# Altium schematic sheet GSM Output Port.SchDoc: GSM Output Port
size 292 x 193 mm; SheetNumber: 3; SheetTotal: 28
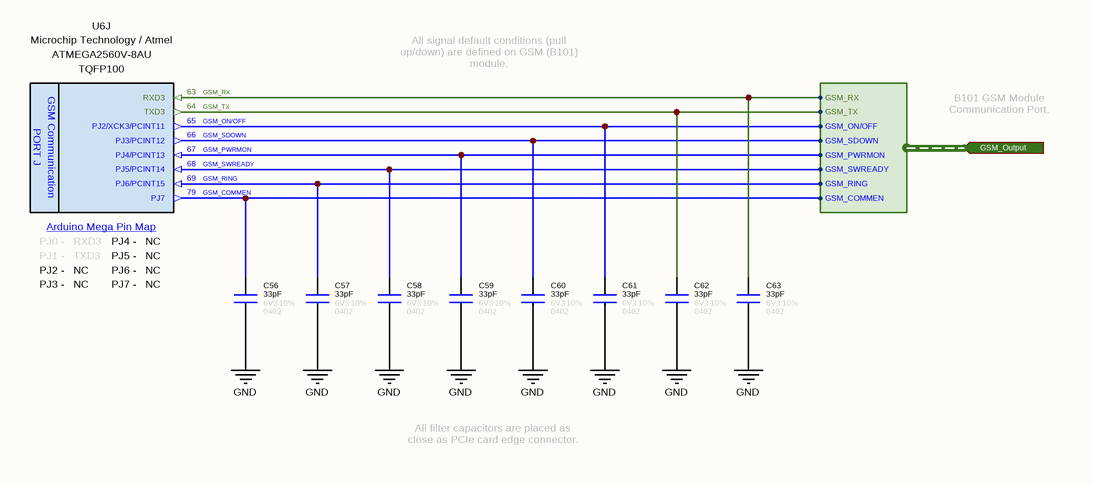
[diagram p0: GSM Output Port.SchDoc]

## Parts
C56  value 33pF  Tolerance: 10%  Case: 0402  Voltage: 6V3  [CAPACITOR_0402]  (hidden comment: Capacitor - 33pF [0402] (Ceramic))
C57  value 33pF  Tolerance: 10%  Case: 0402  Voltage: 6V3  [CAPACITOR_0402]  (hidden comment: Capacitor - 33pF [0402] (Ceramic))
C58  value 33pF  Tolerance: 10%  Case: 0402  Voltage: 6V3  [CAPACITOR_0402]  (hidden comment: Capacitor - 33pF [0402] (Ceramic))
C59  value 33pF  Tolerance: 10%  Case: 0402  Voltage: 6V3  [CAPACITOR_0402]  (hidden comment: Capacitor - 33pF [0402] (Ceramic))
C60  value 33pF  Tolerance: 10%  Case: 0402  Voltage: 6V3  [CAPACITOR_0402]  (hidden comment: Capacitor - 33pF [0402] (Ceramic))
C61  value 33pF  Tolerance: 10%  Case: 0402  Voltage: 6V3  [CAPACITOR_0402]  (hidden comment: Capacitor - 33pF [0402] (Ceramic))
C62  value 33pF  Tolerance: 10%  Case: 0402  Voltage: 6V3  [CAPACITOR_0402]  (hidden comment: Capacitor - 33pF [0402] (Ceramic))
C63  value 33pF  Tolerance: 10%  Case: 0402  Voltage: 6V3  [CAPACITOR_0402]  (hidden comment: Capacitor - 33pF [0402] (Ceramic))
U6  Manufacturer Name: Microchip Technology / Atmel  Case: TQFP100  [TQFP-100]  (hidden comment: ATMEGA2560V-8AU)  (part J of 16)

## Ports
GSM_Output (in, harness GSM_Output)

## Harnesses
GSM_Output: GSM_SDOWN, GSM_ON/OFF, GSM_TX, GSM_RX, GSM_PWRMON, GSM_SWREADY, GSM_RING, GSM_COMMEN

## Nets
GND: C56.1 C57.1 C58.1 C59.1 C60.1 C61.1 C62.1 C63.1
GSM_COMMEN: C56.2 U6.79(PJ7) ; port GSM_Output.GSM_COMMEN
GSM_ON/OFF: C61.2 U6.65(PJ2/XCK3/PCINT11) ; port GSM_Output.GSM_ON/OFF
GSM_PWRMON: C59.2 U6.67(PJ4/PCINT13) ; port GSM_Output.GSM_PWRMON
GSM_RING: C57.2 U6.69(PJ6/PCINT15) ; port GSM_Output.GSM_RING
GSM_RX: C63.2 U6.63(RXD3) ; port GSM_Output.GSM_RX
GSM_SDOWN: C60.2 U6.66(PJ3/PCINT12) ; port GSM_Output.GSM_SDOWN
GSM_SWREADY: C58.2 U6.68(PJ5/PCINT14) ; port GSM_Output.GSM_SWREADY
GSM_TX: C62.2 U6.64(TXD3) ; port GSM_Output.GSM_TX

## Notes on the sheet
- All signal default conditions (pull up/down) are defined on GSM (B101) module.
- B101 GSM Module Communication Port.
- All filter capacitors are placed as close as PCIe card edge connector.
- © 2021 All rights reserved.
  This document may not, in whole or in part, be copied, photocopied, reproduced, translated or converted to any electronic or machine readable from without prior written permission of Mehmet Günce Akkoyun.
  Engineer contact : akkoyun@me.com
- Property of
- Engineer :
- Date :
- Size :
- A4
- Time :
- Project :
- Page :
- /
- Customer :
- Product ID :
- Module ID :
- Version :
- File :
- Revision :
- (in symbol IC - AtMega2560V-8AU, part J) PORT J; GSM Communication; Arduino Mega Pin Map; PJ0 -; PJ4 -; NC; PJ1 -; PJ5 -; PJ2 -; PJ6 -; PJ3 -; PJ7 -

## Library data of the parts
C56-C63 = Capacitor - 33pF [0402-6V3]: Manufacturer Name: Kemet; Manufacturer Part Number: C0402C330J9RACAUTO; ComponentLink1Description: DataSheet; ComponentLink1URL: https://api.kemet.com/component-edge/download/datasheet/C0402C330J9RACAUTO.pdf; ComponentLink2Description: Mouser; ComponentLink2URL: https://www.mouser.com/Search/Refine.aspx?Keyword=80-C0402C330J9RAUTO
U6 = IC - AtMega2560V-8AU: ATmega Series 256 KB Flash 8 KB SRAM 8 MHz 8-Bit Microcontroller - TQFP-100; Program Memory Size: 256 kB; Core: AVR; Operating Supply Voltage: 2.7 V to 5.5 V; Maximum Clock Frequency: 8 MHz; Maximum Operating Temperature: + 85 C; Product Type: MicroControllers; Minimum Operating Temperature: - 40 C; Manufacturer Part Number: ATMEGA2560V-8AU